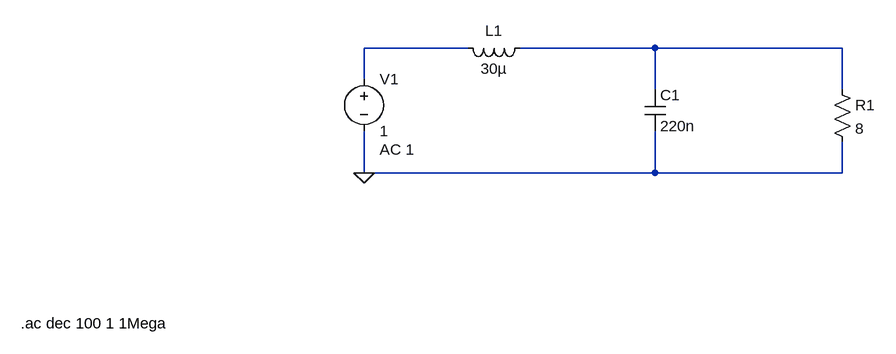
[diagram p0: schematic filtro_salida.asc]
filtro_salida.asc, the LTspice schematic file:
Version 4
SHEET 1 1736 680
WIRE 192 32 32 32
WIRE 480 32 272 32
WIRE 768 32 480 32
WIRE 32 80 32 32
WIRE 480 96 480 32
WIRE 768 96 768 32
WIRE 32 224 32 160
WIRE 480 224 480 160
WIRE 480 224 32 224
WIRE 768 224 768 176
WIRE 768 224 480 224
FLAG 32 224 0
SYMBOL ind 288 16 R90
WINDOW 0 5 56 VBottom 2
WINDOW 3 32 56 VTop 2
SYMATTR InstName L1
SYMATTR Value 30µ
SYMBOL res 752 80 R0
SYMATTR InstName R1
SYMATTR Value 8
SYMBOL cap 464 96 R0
SYMATTR InstName C1
SYMATTR Value 220n
SYMBOL voltage 32 64 R0
WINDOW 123 24 124 Left 2
WINDOW 39 0 0 Left 2
SYMATTR InstName V1
SYMATTR Value 1
SYMATTR Value2 AC 1
TEXT -496 456 Left 2 !.ac dec 100 1 1Mega

The netlist it stands for:
* filtro_salida.asc
L1 N002 N001 30µ
R1 N002 0 8
C1 N002 0 220n
V1 N001 0 1 AC 1
.ac dec 100 1 1Mega
.backanno
.end